# EAGLE design selfcontained low power node v1 (EAGLE 7.3.0)
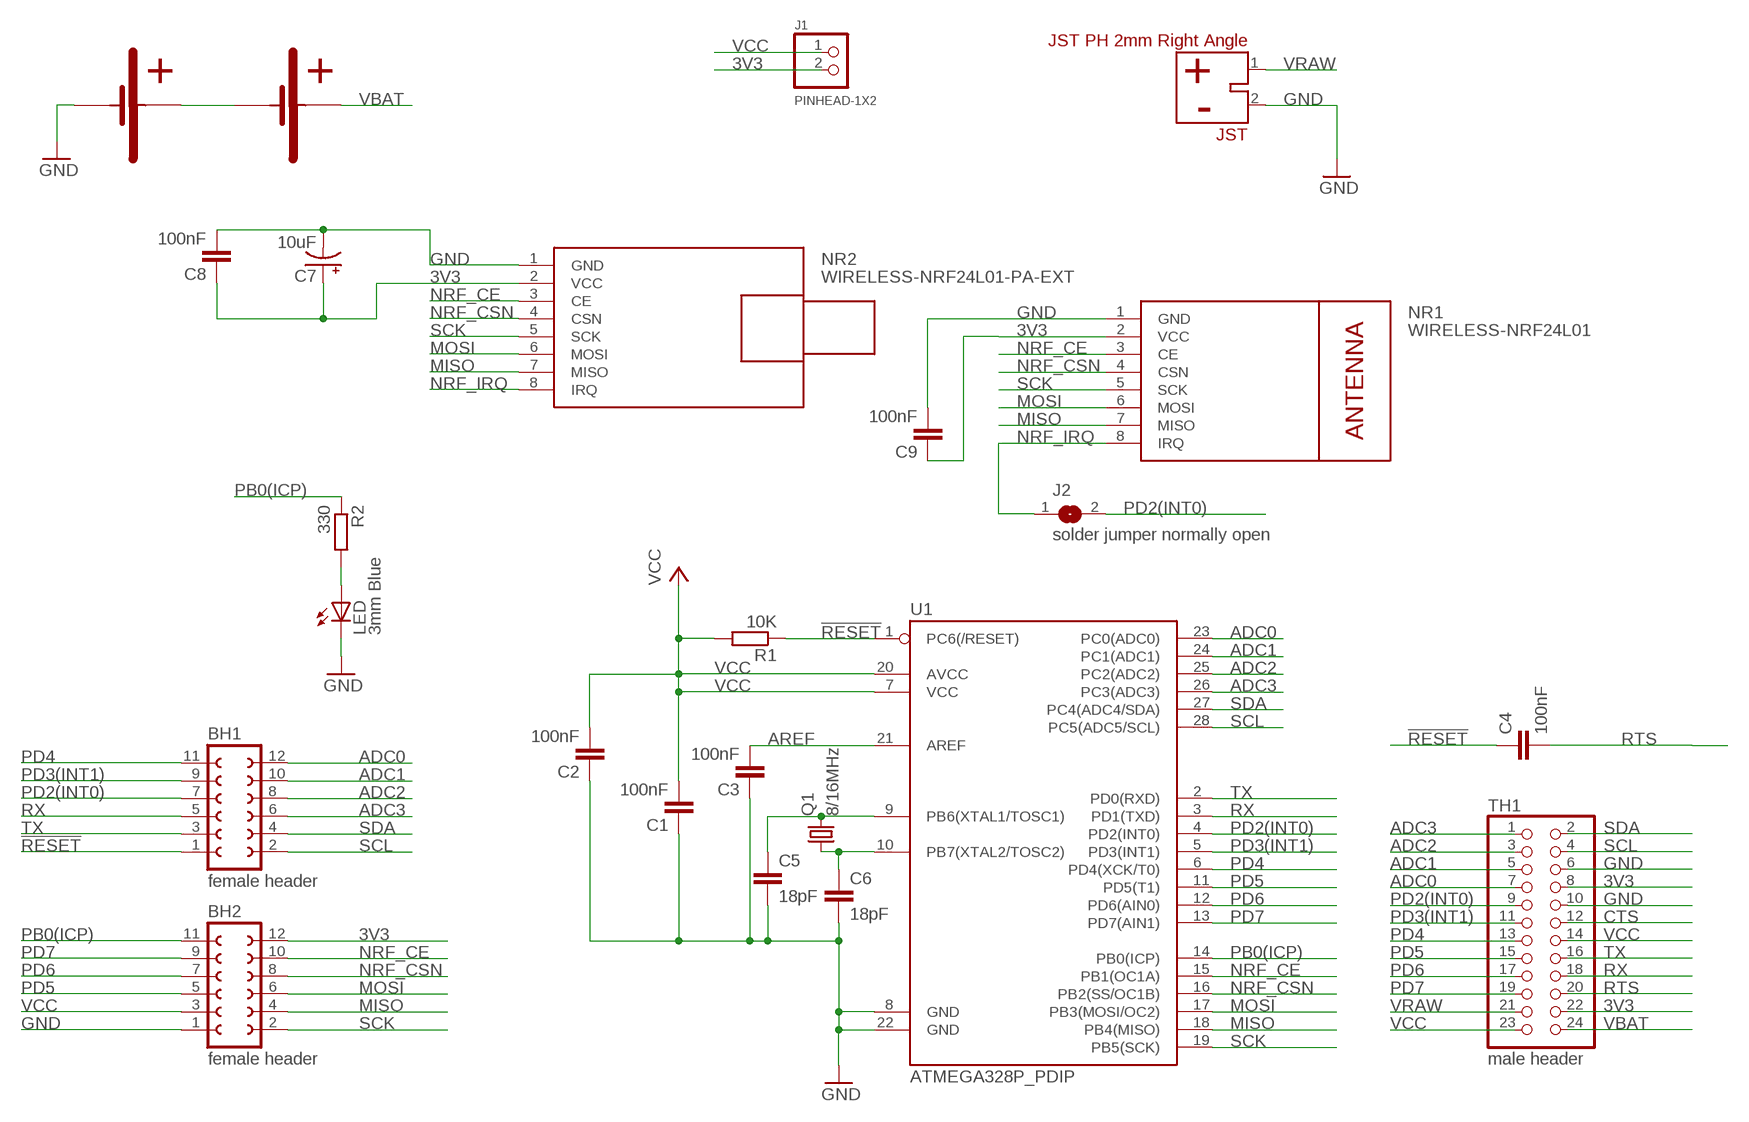
[diagram p0: schematic, sheet 1]

## Parts
BAT1  AAABATTERY  [AAABATTERYHOLDER]
BAT2  AAABATTERY  [AAABATTERYHOLDER]
BH1  female header  FE06-2  [FE06-2]
BH2  female header  FE06-2  [FE06-2]
C1  100nF  C-EU025-025X050  [C025-025X050]
C2  100nF  C-EU025-025X050  [C025-025X050]
C3  100nF  C-EU025-025X050  [C025-025X050]
C4  100nF  C-EU025-025X050  [C025-025X050]
C5  18pF  C-EUC025_050-024X070  [C025_050-024X070]
C6  18pF  C-EUC025_050-024X070  [C025_050-024X070]
C7  10uF  CPOL-USE2.5-5  [E2,5-5]
C8  100nF  C-EU025-025X050  [C025-025X050]
C9  100nF  C-EU025-025X050  [C025-025X050]
J1  PINHEAD-1X2  [PIHEAD-1X2]
J2  solder jumper normally open  SJ  [SJ]
JST  JST PH 2mm Right Angle  JST_2PINJST-PH-2-THM-RA  [JST-PH-2-THM-RA]
LED  3mm Blue  LED3MM  [LED3MM]
NR1  WIRELESS-NRF24L01  [WIRELESS-NRF24L01]
NR2  WIRELESS-NRF24L01-PA-EXT  [WIRELESS-NRD24L01-PA-EXT]
Q1  8/16MHz  CRYSTALHC49S  [HC49/S]
R1  10K  R-EU_0207/2V  [0207/2V]
R2  330  R-EU_0207/2V  [0207/2V]
TH1  male header  PINHD-2X12  [2X12]
U1  ATMEGA328P_PDIP  [DIL28-3]

## Nets
3V3 [power]: BH2.12 C7.+ C8.1 C9.1 J1.2 NR1.2(VCC) NR2.2(VCC) TH1.8 TH1.22
!RESET: BH1.1 C4.1 R1.1 U1.1(PC6(/RESET))
ADC0: BH1.12 TH1.7 U1.23(PC0(ADC0))
ADC1: BH1.10 TH1.5 U1.24(PC1(ADC1))
ADC2: BH1.8 TH1.3 U1.25(PC2(ADC2))
ADC3: BH1.6 TH1.1 U1.26(PC3(ADC3))
AREF [power]: C3.2 U1.21(AREF)
CTS: TH1.12
GND [power]: BAT1.P$1 BH2.1 C1.1 C2.1 C3.1 C5.2 C5.3 C6.2 C6.3 C7.- C8.2 C9.2 JST.2 LED.K(C) NR1.1(GND) NR2.1(GND) TH1.6 TH1.10 U1.8(GND) U1.22(GND)
MISO: BH2.4 NR1.7(MISO) NR2.7(MISO) U1.18(PB4(MISO))
MOSI: BH2.6 NR1.6(MOSI) NR2.6(MOSI) U1.17(PB3(MOSI/OC2))
N$1: LED.A R2.2
N$2 [power]: BAT1.P$2 BAT2.P$1
N$3: C5.1 Q1.2 U1.9(PB6(XTAL1/TOSC1))
N$13: C6.1 Q1.1 U1.10(PB7(XTAL2/TOSC2))
NRF_CE: BH2.10 NR1.3(CE) NR2.3(CE) U1.15(PB1(OC1A))
NRF_CSN: BH2.8 NR1.4(CSN) NR2.4(CSN) U1.16(PB2(SS/OC1B))
NRF_IRQ: J2.1 NR1.8(IRQ) NR2.8(IRQ)
PB0(ICP): BH2.11 R2.1 U1.14(PB0(ICP))
PD2(INT0): BH1.7 J2.2 TH1.9 U1.4(PD2(INT0))
PD3(INT1): BH1.9 TH1.11 U1.5(PD3(INT1))
PD4: BH1.11 TH1.13 U1.6(PD4(XCK/T0))
PD5: BH2.5 TH1.15 U1.11(PD5(T1))
PD6: BH2.7 TH1.17 U1.12(PD6(AIN0))
PD7: BH2.9 TH1.19 U1.13(PD7(AIN1))
RTS: C4.2 TH1.20
RX: BH1.5 TH1.18 U1.3(PD1(TXD))
SCK: BH2.2 NR1.5(SCK) NR2.5(SCK) U1.19(PB5(SCK))
SCL: BH1.2 TH1.4 U1.28(PC5(ADC5/SCL))
SDA: BH1.4 TH1.2 U1.27(PC4(ADC4/SDA))
TX: BH1.3 TH1.16 U1.2(PD0(RXD))
VBAT [power]: BAT2.P$2 TH1.24
VCC [power]: BH2.3 C1.2 C2.2 J1.1 R1.2 TH1.14 TH1.23 U1.7(VCC) U1.20(AVCC)
VRAW [raw]: JST.1 TH1.21

## Library data of the parts
BAT1 BAT2 = GertSanders:AAABATTERY
BH1 BH2 = GertSanders:FE06-2: FEMALE HEADER; OC_FARNELL: unknown; OC_NEWARK: unknown
C1-C4 C8 C9 = resistor:C-EU: CAPACITOR, European symbol
C5 C6 = GertSanders:C-EU: CAPACITOR, European symbol
C7 = adafruit:CPOL-US: POLARIZED CAPACITOR, American symbol
J1 = BaseApp:PINHEAD-1X2
J2 = jumper:SJ: SMD solder JUMPER
JST = GertSanders:JST_2PIN: JST 2-Pin Connectors of various flavors SMT-RA (S2B-PH-SM4) 4UConnector #17311 SMT (B2B-PH-SM4) THM-RA (S2B-PH) THM (B2B-PH)
LED = adafruit:LED: LED OSRAM: - CHIPLED LG R971, LG N971, LY N971, LG Q971, LY Q971, LO R971, LY R971 LH N974, LH R974 LS Q976, LO Q976, LY Q976 LO Q996 - Hyper CHIPLED LW Q18S LB Q993, LB Q99A, LB R99A - SideLED LS A670, LO A670, LY A670, LG A670, LP A670 LB A673, LV A673, LT A673, LW A673 LH A674 LY A675 LS A676, LA A676, LO A676, LY A676, LW A676 LS A679, LY A679, LG A679 - Hyper Micro SIDELED® LS Y876, LA Y876, LO Y876, LY Y876 LT Y87S - SmartLED LW L88C, LW L88S LB L89C, LB L89S, LG L890 LS L89K, LO L89K, LY L89K LS L896, LA L896, LO L896, LY L896 - TOPLED LS T670, LO T670, LY T670, LG T670, LP T670 LSG T670, LSP T670, LSY T670, LOP T670, LYG T670 LG T671, LOG T671, LSG T671 LB T673, LV T673, LT T673, LW T673 LH T674 LS T676, LA T676, LO T676, LY T676, LB T676, LH T676, LSB T676, LW T676 LB T67C, LV T67C, LT T67C, LS T67K, LO T67K, LY T67K, LW E67C LS E67B, LA E67B, LO E67B, LY E67B, LB E67C, LV E67C, LT E67C LW T67C LS T679, LY T679, LG T679 LS T770, LO T770, LY T770, LG T770, LP T770 LB T773, LV T773, LT T773, LW T773 LH T774 LS E675, LA E675, LY E675, LS T675 LS T776, LA T776, LO T776, LY T776, LB T776 LHGB T686 LT T68C, LB T68C - Hyper Mini TOPLED® LB M676 - Mini TOPLED Santana® LG M470 LS M47K, LO M47K, LY M47K Source: http://www.osram.convergy.de/
NR1 = GertSanders:WIRELESS-NRF24L01: 2.4 GHz Wireless Module based on NRF24L01 chip
NR2 = GertSanders:WIRELESS-NRF24L01-PA-EXT: 2.4 GHz Wireless Module based on NRF24L01 chip with preamplifier and external antenna
Q1 = crystal:CRYSTAL: CRYSTAL; OC_FARNELL: 1667008; OC_NEWARK: unknown
R1 R2 = resistor:R-EU_: RESISTOR, European symbol
TH1 = pinhead:PINHD-2X12: PIN HEADER
U1 = GertSanders:ATMEGA328P_PDIP: uC used in the Arduino 32kb flash, 1k EEPROM, 2k SRAM This is the through-hole version of this chip.

## Net classes
0 default: width 0.254 mm
1 power: width 0.508 mm, clearance 0.203 mm
2 raw: width 0.559 mm, clearance 0.203 mm

## Board
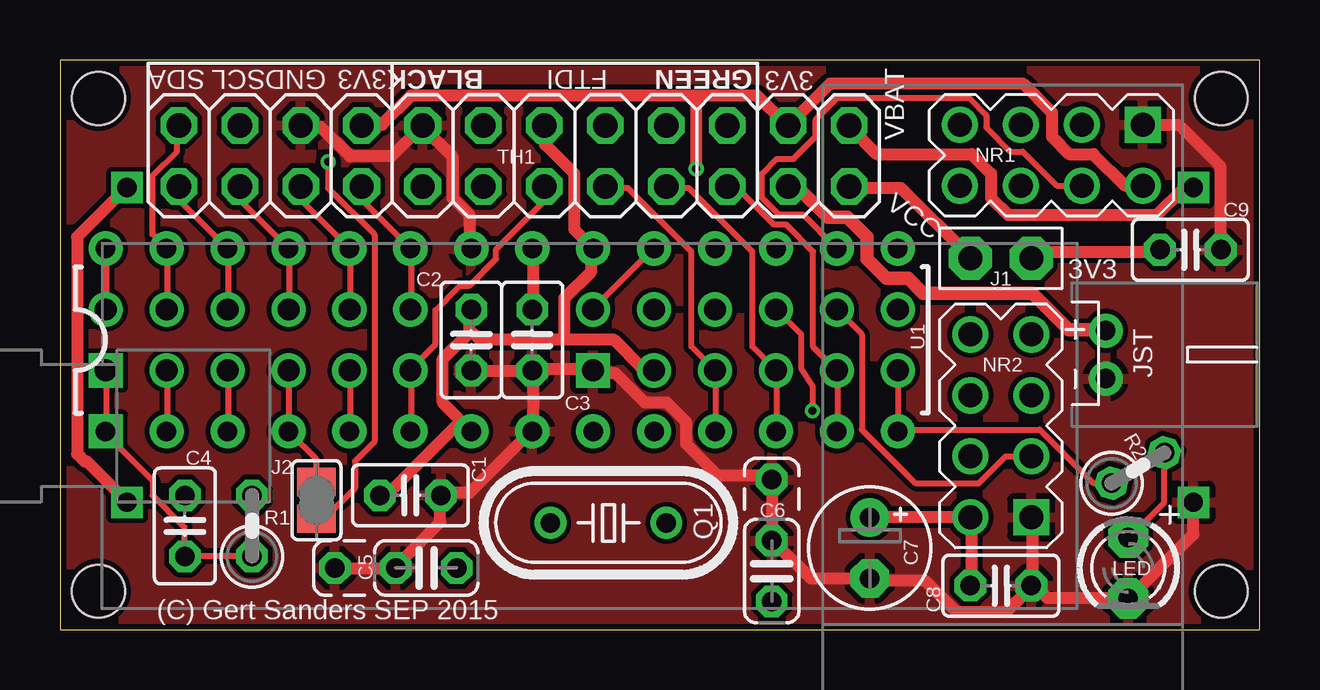
[diagram p1: board, top side]
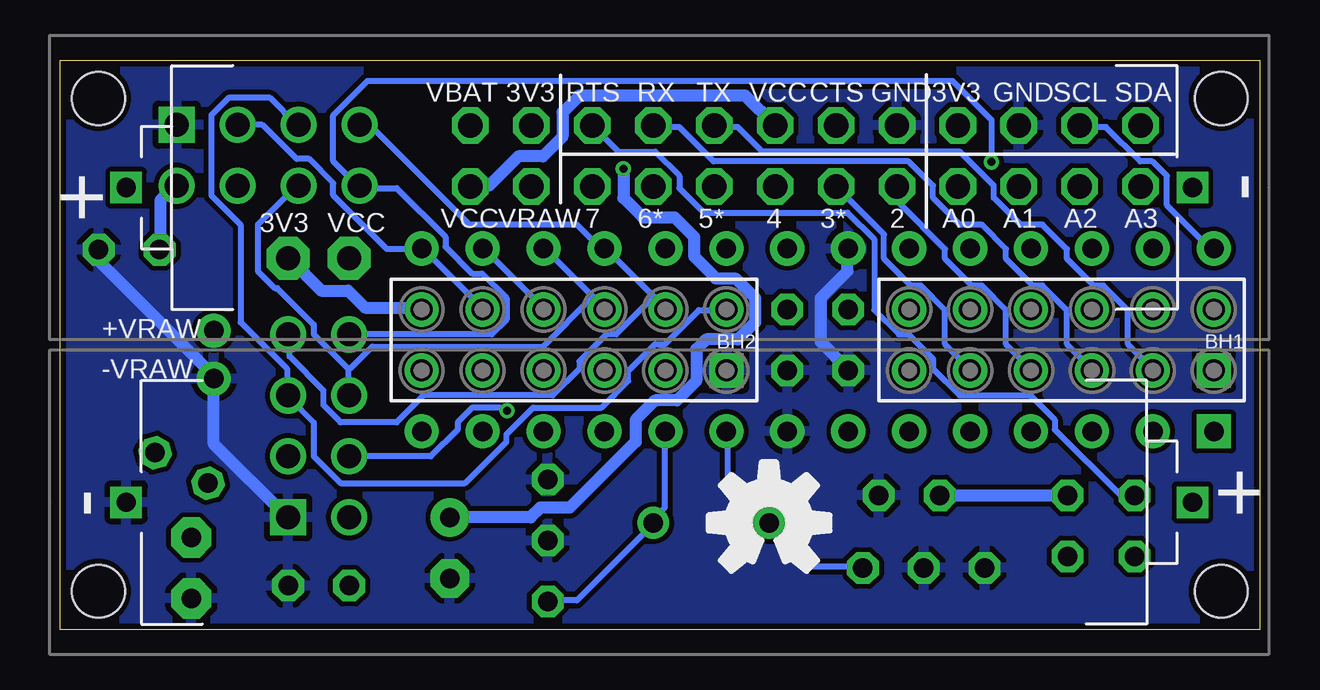
[diagram p2: board, bottom side, seen from below]

Size 50 x 23.73 mm. Coordinates in mm from the lower left corner, seen from the top.
Outline: 0,0 50,0 50,23.73 0,23.73 0,0
Copper layers (1*16): Top 0.035mm / dielectric 1.5mm / Bottom 0.035mm
Design rules "dirt_cheap_dirty_boards.v1": minimum track width 5mil, minimum drill 12mil, track to track 5mil, track to pad 5mil, pad to pad 5mil, via to via 5mil, smd to smd 0mil, copper to edge 10mil, drill to drill 10mil, minimum pad ring 10mil, minimum via ring 6mil, stop-mask expansion 2mil, vias tented up to drill 25mil, thermal gap 10mil
Holes 2.2 mm at 1.6,1.6 1.6,22.13 48.4,22.13 48.4,1.6

### Footprints (pad centres in the part's own frame; a part is rotated, then mirrored left to right if it is on the bottom)
AAABATTERYHOLDER = drill 0.8 square: P$1 -22.225,0; P$2 22.225,0
FE06-2 = drill 0.914 square: 1 -6.35,1.27 | drill 0.914: 2 -6.35,-1.27; 3 -3.81,1.27; 4 -3.81,-1.27; 5 -1.27,1.27; 6 -1.27,-1.27; 7 1.27,1.27; 8 1.27,-1.27; 9 3.81,1.27; 10 3.81,-1.27; 11 6.35,1.27; 12 6.35,-1.27
C025-025X050 = drill 0.813 octagon: 1 -1.27,0; 2 1.27,0
C025_050-024X070 = drill 0.813 octagon: 1 1.27,0; 2 -1.27,0; 3 -3.81,0
E2,5-5 = drill 0.813 pad 1.6: + -1.27,0 | drill 0.813 pad 1.6 octagon: - 1.27,0
PIHEAD-1X2 = drill 1.016 pad 1.778 octagon: 1 -1.27,0; 2 1.27,0
SJ = smd 1.168 x 1.6: 1 -0.762,0; 2 0.762,0
JST-PH-2-THM-RA = drill 0.8 pad 1.422: 1 -1,0; 2 1,0
LED3MM = drill 0.813 pad 1.676 octagon: A -1.27,0; K 1.27,0
WIRELESS-NRF24L01 = drill 1 square: 1 -12.7,6.35 | drill 1: 2 -10.16,6.35; 3 -12.7,3.81; 4 -10.16,3.81; 5 -12.7,1.27; 6 -10.16,1.27; 7 -12.7,-1.27; 8 -10.16,-1.27
WIRELESS-NRD24L01-PA-EXT = drill 1 square: 1 -17.755,3.81 | drill 1: 2 -15.215,3.81; 3 -17.755,1.27; 4 -15.215,1.27; 5 -17.755,-1.27; 6 -15.215,-1.27; 7 -17.755,-3.81; 8 -15.215,-3.81
HC49/S = drill 0.813: 1 -2.413,0; 2 2.413,0
0207/2V = drill 0.813 octagon: 1 -1.27,0; 2 1.27,0
2X12 = drill 1.016 octagon: 1 -13.97,-1.27; 2 -13.97,1.27; 3 -11.43,-1.27; 4 -11.43,1.27; 5 -8.89,-1.27; 6 -8.89,1.27; 7 -6.35,-1.27; 8 -6.35,1.27; 9 -3.81,-1.27; 10 -3.81,1.27; 11 -1.27,-1.27; 12 -1.27,1.27; 13 1.27,-1.27; 14 1.27,1.27; 15 3.81,-1.27; 16 3.81,1.27; 17 6.35,-1.27; 18 6.35,1.27; 19 8.89,-1.27; 20 8.89,1.27; 21 11.43,-1.27; 22 11.43,1.27; 23 13.97,-1.27; 24 13.97,1.27
DIL28-3 = drill 0.813 pad 1.422 square: 1 -16.51,-3.81 | drill 0.813 pad 1.422: 2 -13.97,-3.81; 3 -11.43,-3.81; 4 -8.89,-3.81; 5 -6.35,-3.81; 6 -3.81,-3.81; 7 -1.27,-3.81; 8 1.27,-3.81; 9 3.81,-3.81; 10 6.35,-3.81; 11 8.89,-3.81; 12 11.43,-3.81; 13 13.97,-3.81; 14 16.51,-3.81; 15 16.51,3.81; 16 13.97,3.81; 17 11.43,3.81; 18 8.89,3.81; 19 6.35,3.81; 20 3.81,3.81; 21 1.27,3.81; 22 -1.27,3.81; 23 -3.81,3.81; 24 -6.35,3.81; 25 -8.89,3.81; 26 -11.43,3.81; 27 -13.97,3.81; 28 -16.51,3.81

### Placement (x,y rotation side)
BAT1  25.02,5.3 0 bottom
BAT2  25.02,18.41 180 bottom
BH1  8.26,12.06 180 bottom
BH2  28.57,12.06 180 bottom
C1  14.61,5.59 180 top
C2  17.14,12.06 90 top
C3  19.68,12.06 90 top
C4  5.21,4.32 90 top
C5  15.27,2.57 0 top
C6  29.67,2.44 270 top
C7  33.76,3.4 270 top
C8  39.22,1.83 0 top
C9  47.12,15.82 0 top
J1  39.22,15.47 0 top
J2  10.69,5.38 90 top
JST  43.59,11.46 270 top
LED  44.53,2.57 270 top
NR1  38.79,8.33 270 top
NR2  22.73,8.48 180 top
Q1  22.86,4.45 180 top
R1  8,4.32 90 top
R2  44.93,6.73 30 top
TH1  18.92,19.74 0 top
U1  18.41,12.06 0 top
U$1  [OSHWLOGO_TOL_0.2]  20.45,4.45 0 bottom

### Tracks (layer width: path | path; a pad name or v marks a point on that pad's centre or on a via)
3V3  (via drill 0.33)
  Top 0.508: C9.1 45.82,15.75 40.74,15.75 40.54,15.54 J1.2 | C8.1 38,1.83 38,4.67 NR2.2 37.8,4.67 33.83,4.67 C7.+ | 26.52,22.25 29.06,22.25 30.28,21.03 TH1.22 30.48,21.13 32.11,22.76 40.13,22.76 41.35,21.54 41.35,20.52 42.06,19.81 43.08,19.81 44.4,18.49 45.11,18.49 NR1.2 | 26.52,22.25 14.63,22.25 13.41,21.03 12.6,21.03 TH1.8 | v26.52,19.2 26.52,22.05 26.52,22.25
  Bottom 0.508: C9.1 45.82,15.85 45.82,17.88 45.21,18.49 NR1.2 | BH2.12 34.95,13.41 37.29,13.41 38,14.12 39.12,14.12 40.44,15.44 J1.2 | v26.52,19.2 26.52,17.98 25.7,17.17 24.38,17.17 23.57,16.36 23.57,15.54 22.66,14.63 21.84,14.63 21.03,13.82 21.03,12.8 21.74,12.09 23.06,12.09 23.47,11.68 23.47,10.36 24.28,9.55 25.2,9.55 26.01,8.74 26.01,7.82 28.75,5.08 29.97,5.08 30.38,4.67 33.73,4.67 C7.+
!RESET
  Top 0.254: R1.1 7.92,3.05 5.28,3.05 C4.1 5.18,3.15 5.18,4.27 3.86,5.59 3.86,6.2 1.93,8.13 U1.1 1.93,8.33 1.93,10.77 BH1.1
ADC0
  Top 0.254: BH1.12 14.63,13.41 14.63,15.85 U1.23 14.53,15.95 12.6,17.88 12.6,18.39 TH1.7
ADC1
  Top 0.254: BH1.10 12.09,13.41 12.09,15.85 U1.24 11.99,15.95 10.06,17.88 10.06,18.39 TH1.5
ADC2
  Top 0.254: BH1.8 9.55,13.41 9.55,15.85 U1.25 9.45,15.95 7.52,17.88 7.52,18.39 TH1.3
ADC3
  Top 0.254: BH1.6 7.01,13.41 7.01,15.85 U1.26 6.91,15.95 4.98,17.88 4.98,18.39 TH1.1
AREF
  Top 0.508: C3.2 19.71,13.41 19.71,15.85 U1.21
GND
  Top 0.508: U1.22 17.07,15.95 17.07,17.27 16.36,17.98 16.36,19.71 15.14,20.93 TH1.10 14.94,20.83 13.82,19.71 12.09,19.71 10.87,20.93 10.06,20.93 TH1.6 | C5.3 11.48,2.54 13.92,2.54 C5.2 14.12,2.74 15.85,4.47 15.85,5.59 C1.1 16.05,5.69 17.07,5.69 19.51,8.13 U1.8 19.71,8.33 19.71,10.57 C3.1 | C2.1 17.17,10.77 19.61,10.77 C3.1 | C3.1 19.91,10.87 22.15,10.87 BH2.1 22.45,10.67 23.16,10.67 24.38,9.45 25.3,9.45 26.11,8.64 26.11,7.72 27.43,6.4 29.46,6.4 C6.3 29.67,6.2 29.67,3.76 C6.2 29.87,3.56 31.29,2.13 33.73,2.13 C7.- 33.93,2.03 36.07,2.03 37.39,0.71 39.42,0.71 40.34,1.63 C8.2 | C9.2 48.36,15.85 48.36,19.3 46.63,21.03 45.21,21.03 NR1.1 | BAT1.P$1 47.24,5.28 47.24,3.96 44.6,1.32 LED.K 44.3,1.32 41.15,1.32 40.74,1.73 C8.2 | C8.2 40.54,1.83 40.54,4.67 NR2.1
  Bottom 0.508: U1.22 17.17,15.85 17.17,14.94 18.29,13.82 18.29,11.99 17.17,10.87 C2.1 | NR2.1 40.54,4.67 43.59,7.72 43.59,10.36 JST.2 43.69,10.67 48.36,15.34 48.36,15.75 C9.2
  pour Top: -2.54,-2.54 50.8,-2.54 50.8,25.4 -2.54,25.4
  pour Bottom: -2.54,-2.54 50.8,-2.54 50.8,25.4 -2.54,25.4
MISO
  Bottom 0.254: 25.25,13.87 27.23,15.85 U1.18 27.43,15.85 28.45,16.87 32.92,16.87 37.08,21.03 37.49,21.03 NR1.7 | 25.25,13.87 24.79,13.41 BH2.4 | NR2.7 40.44,12.29 40.44,11.38 39.01,9.96 39.01,9.35 38.3,8.64 35.97,8.64 34.85,9.75 29.46,9.75 28.35,10.87 28.35,11.18 27.23,12.29 26.82,12.29 25.3,13.82 25.25,13.87
MOSI
  Bottom 0.254: 27.79,13.87 29.77,15.85 U1.17 | 27.79,13.87 27.33,13.41 BH2.6 | 38,10.87 38,9.75 NR2.6 | 38,10.87 39.42,12.29 39.42,12.7 40.95,14.22 41.05,14.22 41.76,14.94 41.76,16.87 40.13,18.49 NR1.6 | 27.79,13.87 27.84,13.82 29.87,11.79 36.98,11.79 37.9,10.87 38,10.87
N$1
  Top 0.254: R2.2 46.02,7.32 46.02,5.28 44.6,3.86 LED.A
N$2
  Top 0.508: BAT1.P$2 2.74,5.38 1.12,7.01 1.02,7.01 0.71,7.32 0.71,16.36 2.74,18.39 BAT2.P$1
N$3
  Bottom 0.254: C5.1 16.56,2.64 18.69,2.64 20.42,4.37 Q1.2 20.42,4.57 22.15,6.3 22.15,8.23 U1.9
N$13
  Bottom 0.254: C6.1 29.67,1.22 28.45,1.22 25.3,4.37 Q1.1 25.3,4.57 24.79,5.08 24.79,8.23 U1.10
NRF_CE
  Top 0.254: NR2.3 40.44,7.21 39.42,7.21 38.3,6.1 35.66,6.1 33.43,8.33 33.43,12.29 32.41,13.31 BH2.10
  Bottom 0.254: BH2.10 32.41,13.41 34.85,15.85 U1.15 35.05,15.85 36.37,15.85 38.61,18.09 38.61,18.59 39.62,19.61 40.13,19.61 41.55,21.03 42.57,21.03 NR1.3
NRF_CSN  (via drill 0.33)
  Top 0.254: v31.37,9.12 31.37,10.13 30.89,10.87 30.89,12.29 29.87,13.31 BH2.8 | NR1.4 42.57,18.49 41.55,18.49 40.13,19.91 39.62,19.91 38.61,20.93 38.61,21.44 37.9,22.15 32.41,22.15 31.5,21.23 31.5,20.52 30.58,19.61 29.87,19.61 29.26,19 29.26,17.98 29.97,17.27 30.99,17.27 32.31,15.95 U1.16
  Bottom 0.254: BH2.8 29.87,13.41 32.31,15.85 U1.16 | v31.37,9.12 31.7,9.25 32.82,9.25 33.43,8.64 33.43,8.33 34.54,7.21 37.9,7.21 NR2.4
NRF_IRQ  (via drill 0.33)
  Top 0.254: v11.18,19.48 11.18,18.39 13.11,16.46 13.11,7.82 12.29,7.01 12.29,5.89 11.07,4.67 10.77,4.67 J2.1
  Bottom 0.254: v11.18,19.48 11.18,21.23 12.8,22.86 37.19,22.86 38.61,21.44 38.61,19.51 37.59,18.49 NR1.8 37.49,18.39 35.97,18.39 33.93,16.36 33.93,15.95 32.82,14.83 32.41,14.83 31.39,13.82 31.39,12.9 32,12.29 37.9,12.29 NR2.8
PB0(ICP)
  Top 0.254: R2.1 43.79,6.1 43.08,6.1 40.84,8.33 34.95,8.33 U1.14 34.95,8.43 34.95,10.77 BH2.11
PD2(INT0)
  Top 0.254: J2.2 10.67,6.2 10.67,7.11 9.55,8.23 U1.4 9.55,8.33 9.55,10.77 BH1.7
  Bottom 0.254: TH1.9 15.04,18.39 15.04,17.78 13.11,15.85 13.11,15.44 11.99,14.33 11.58,14.33 10.57,13.31 10.57,11.89 9.55,10.87 BH1.7
PD3(INT1)
  Top 0.254: U1.5 12.09,8.33 12.09,10.77 BH1.9
  Bottom 0.254: TH1.11 17.58,18.39 15.65,16.46 15.65,15.44 14.53,14.33 14.12,14.33 13.11,13.31 13.11,11.89 12.09,10.87 BH1.9
PD4
  Top 0.254: U1.6 14.63,8.33 14.63,10.77 BH1.11 14.63,10.87 15.65,11.89 15.65,13.31 16.66,14.33 17.07,14.33 18.19,15.44 18.19,15.85 20.12,17.78 20.12,18.39 TH1.13
PD5
  Top 0.254: U1.11 27.33,8.33 27.33,10.77 BH2.5 27.23,10.87 26.31,11.79 26.31,15.75 23.67,18.39 22.76,18.39 TH1.15
PD6
  Top 0.254: U1.12 29.87,8.33 29.87,10.77 BH2.7 29.77,10.87 28.85,11.79 28.85,15.75 26.21,18.39 25.3,18.39 TH1.17
PD7
  Top 0.254: U1.13 32.41,8.33 32.41,10.77 BH2.9 32.31,10.87 31.39,11.79 31.39,15.75 30.28,16.87 29.77,16.87 28.25,18.39 27.84,18.39 TH1.19
RTS
  Bottom 0.254: C4.2 5.28,5.59 5.79,5.59 8.53,8.33 8.53,8.74 9.55,9.75 12.5,9.75 13.61,10.87 13.61,11.28 14.63,12.29 15.04,12.29 16.05,13.31 16.05,16.26 17.17,17.37 23.16,17.37 24.18,18.39 24.18,18.9 25.2,19.91 26.72,19.91 27.74,20.93 TH1.20
RX
  Top 0.254: U1.3 7.01,8.33 7.01,10.77 BH1.5
  Bottom 0.254: TH1.18 25.2,20.93 24.18,20.93 22.76,19.51 14.63,19.51 13.61,18.49 13.61,17.98 12.5,16.87 11.58,16.87 10.57,15.85 10.57,15.44 9.45,14.33 9.04,14.33 8.03,13.31 8.03,11.89 7.01,10.87 BH1.5
SCK
  Top 0.254: BH2.2 22.25,13.41 24.69,15.85 U1.19
  Bottom 0.254: NR1.5 40.13,21.03 41.25,22.15 42.98,22.15 43.69,21.44 43.69,18.09 42.47,16.87 42.47,12.8 40.54,10.87 40.54,9.75 NR2.5 40.44,9.65 39.42,8.64 39.42,7.21 38.3,6.1 33.12,6.1 31.39,7.82 31.39,8.13 30.28,9.25 27.43,9.25 26.31,10.36 26.31,10.77 25.2,11.89 24.79,11.89 23.37,13.31 22.25,13.31 BH2.2
SCL
  Top 0.254: BH1.2 1.93,13.41 1.93,15.85 U1.28
  Bottom 0.254: TH1.4 7.42,20.93 6.4,20.93 4.98,19.51 4.47,19.51 3.86,18.9 3.86,17.68 2.13,15.95 1.93,15.95 U1.28
SDA
  Top 0.254: BH1.4 4.47,13.41 4.47,15.85 U1.27 4.37,15.95 3.86,16.46 3.86,18.9 4.88,19.91 4.88,20.93 TH1.2
TX
  Top 0.254: U1.2 4.47,8.33 4.47,10.77 BH1.3
  Bottom 0.254: TH1.16 22.66,20.93 21.74,20.93 20.73,19.91 12.5,19.91 11.07,18.49 11.07,17.98 9.96,16.87 9.04,16.87 8.03,15.85 8.03,15.44 6.91,14.33 6.5,14.33 5.49,13.31 5.49,11.89 4.47,10.87 BH1.3
VBAT
  Top 0.508: BAT2.P$2 47.24,18.39 46.84,18.39 45.72,17.27 39.52,17.27 38.81,17.98 38.81,19 38,19.81 34.04,19.81 32.92,20.93 TH1.24
VCC
  Top 0.508: TH1.23 32.92,18.39 35.05,18.39 37.9,15.54 J1.1 | 17.07,12.39 17.07,13.31 C2.2 | 17.07,12.39 15.95,11.28 15.95,9.45 17.07,8.33 U1.7 16.56,8.53 13.61,5.59 13.41,5.59 C1.2 | 21.03,12.09 17.48,12.09 17.27,12.29 17.07,12.39 | 21.03,12.09 23.06,12.09 24.28,10.87 24.69,10.87 BH2.3 | 21.03,12.09 21.03,12.29 21.03,13.82 22.15,14.94 22.15,15.85 U1.20 22.05,16.05 21.44,16.66 21.44,19 20.22,20.22 20.22,20.93 TH1.14
  Bottom 0.508: R1.2 8.03,5.59 13.31,5.59 C1.2 | TH1.23 32.82,18.49 32.11,18.49 30.89,19.71 29.87,19.71 29.06,20.52 29.06,21.54 28.35,22.25 21.44,22.25 20.22,21.03 TH1.14
VRAW
  Top 0.559: JST.1 43.59,12.5 42.06,12.5 40.54,14.02 35.97,14.02 35.36,14.63 34.44,14.63 33.63,15.44 33.63,16.36 32.82,17.17 32,17.17 30.79,18.39 30.38,18.39 TH1.21

### Text on the board
tPlace: SDA | SCL | GND | 3V3 | BLACK | FTDI | GREEN | 3V3 | VBAT | VCC | 3V3 | (C) Gert Sanders SEP 2015
bPlace: SDA | SCL | GND | 3V3 | GND | CTS | VCC | TX | RX | RTS | 3V3 | VBAT | A3 | A2 | A1 | A0 | 2 | 3* | 4 | 5* | 6* | 7 | VRAW | VCC | VCC | 3V3 | +VRAW | -VRAW